# EAGLE design design1 (EAGLE 9.5.1)

## Sheet 1 of 2
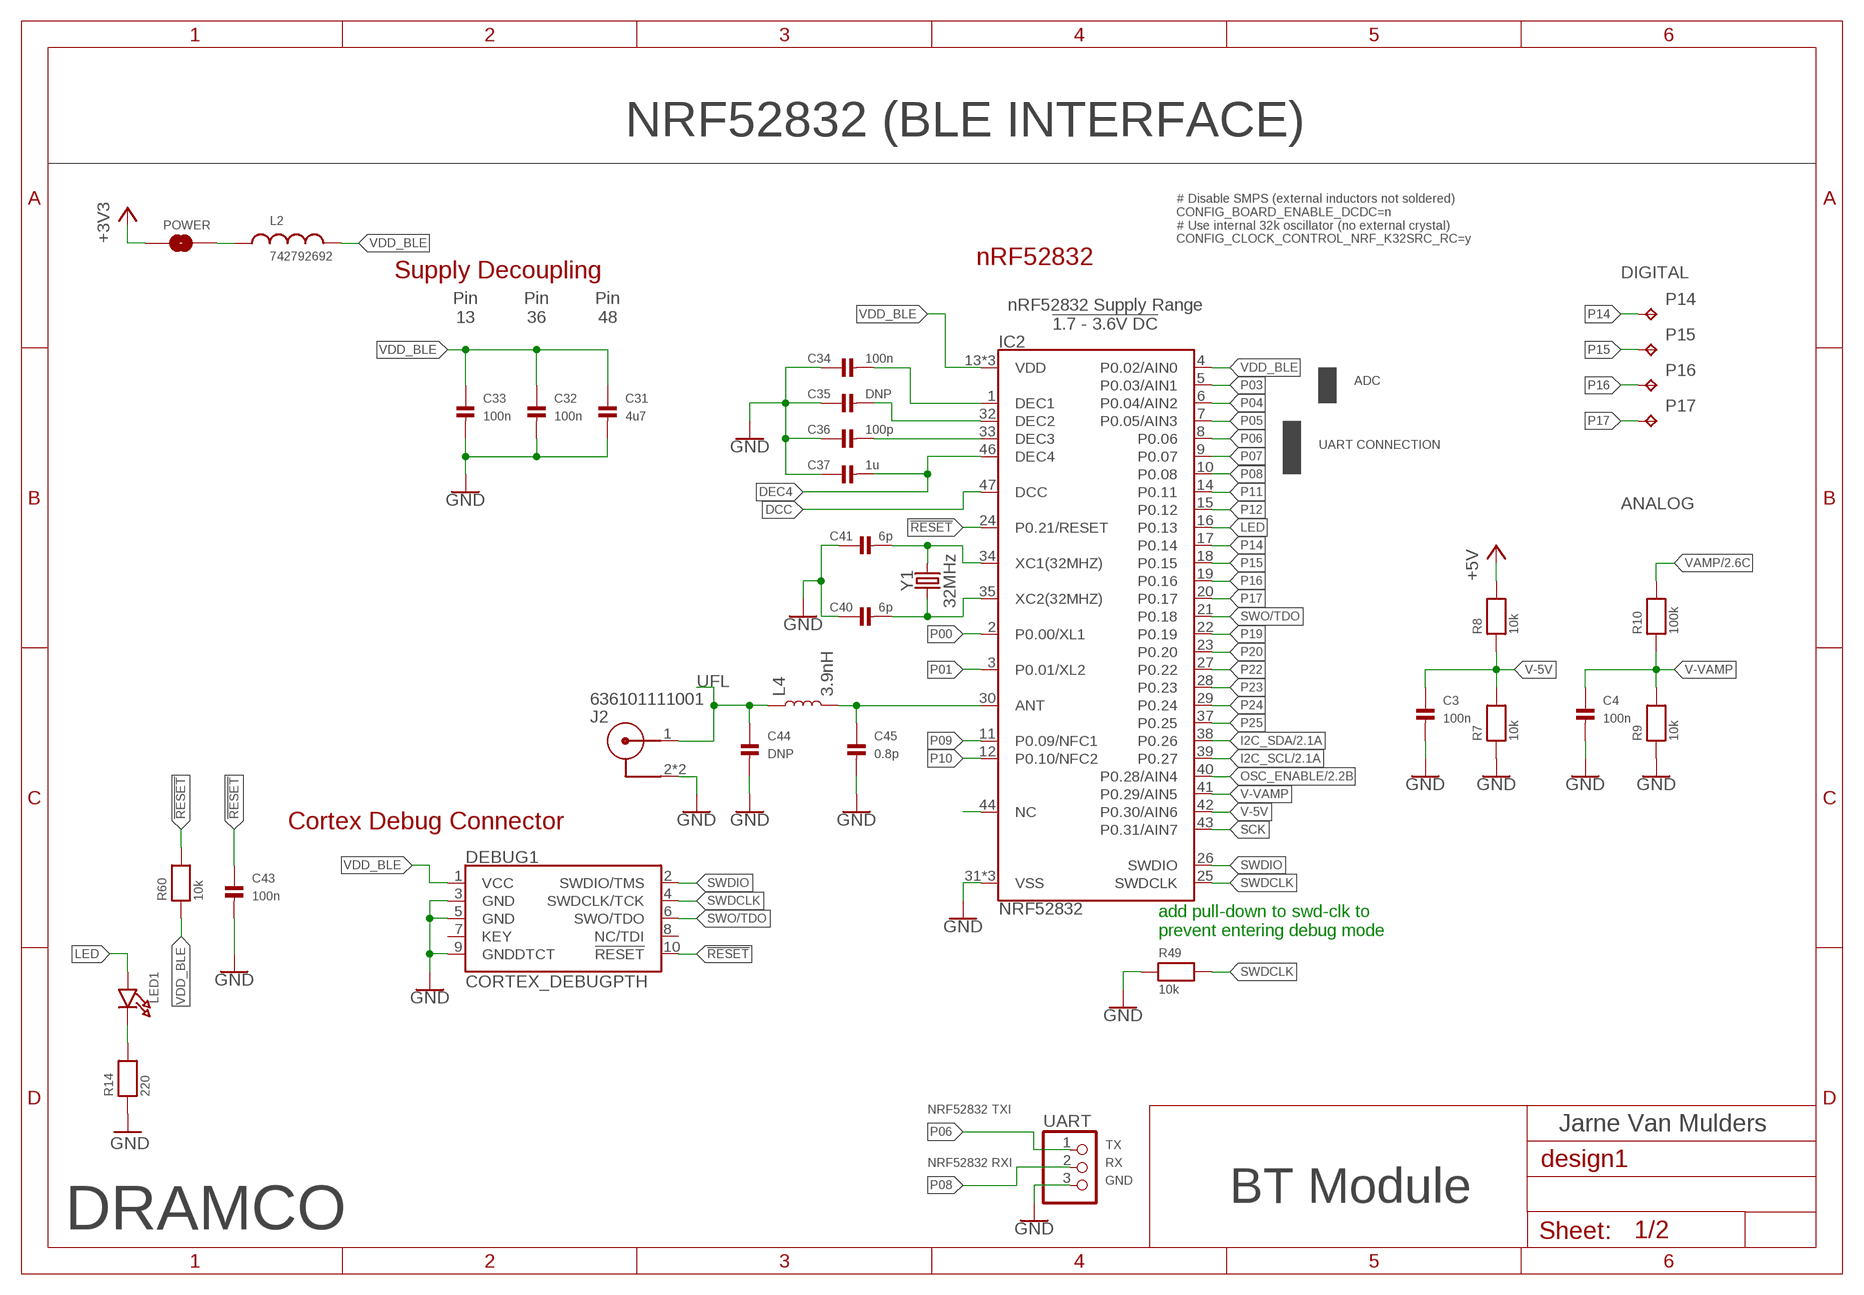
[diagram p0: schematic, sheet 1]

### Parts
C3  100n  CAP_CERAMIC0402  [0402]
C4  100n  CAP_CERAMIC0402  [0402]
C31  4u7  CAP_CERAMIC0603  [0603]
C32  100n  CAP_CERAMIC0402  [0402]
C33  100n  CAP_CERAMIC0402  [0402]
C34  100n  CAP_CERAMIC0402  [0402]
C35  DNP  CAP_CERAMIC0402  [0402]
C36  100p  CAP_CERAMIC0402  [0402]
C37  1u  CAP_CERAMIC0402  [0402]
C40  6p  CAP_CERAMIC0402  [0402]
C41  6p  CAP_CERAMIC0402  [0402]
C43  100n  CAP_CERAMIC0402  [0402]
C44  DNP  CAP_CERAMIC0402  [0402]
C45  0.8p  CAP_CERAMIC0402  [0402]
DEBUG1  CORTEX_DEBUGPTH  [2X5-PTH-1.27MM]
IC2  NRF52832  NRF52832-EXTENDED  [QFN48-6X6MM-EXTENDED]
J2  636101111001  [636101111001]
L2  742792692  WE-CBF_0603_742792692_WB_HS  [WE-CBF_0603(W=2.2)]
L4  3.9nH  INDUCTOR-0402-3.9NH  [0402]
LED1  LED0805  [CHIPLED_0805]
P14  TPTP10SQ  [TP10SQ]
P15  TPTP10SQ  [TP10SQ]
P16  TPTP10SQ  [TP10SQ]
P17  TPTP10SQ  [TP10SQ]
POWER  JUMPER-SMT_2_NO_NO-SILK  [SMT-JUMPER_2_NO_NO-SILK]
R7  10k  RESISTOR0402  [0402]
R8  10k  RESISTOR0402  [0402]
R9  10k  RESISTOR0402  [0402]
R10  100k  RESISTOR0402  [0402]
R14  220  RESISTOR0603  [0603]
R49  10k  RESISTOR0402  [0402]
R60  10k  RESISTOR0402  [0402]
UART  HEADER-1X3ROUND  [1X03_ROUND]
Y1  32MHz  CRYSTAL-32MHZ-SMD-2.0X1.6MM  [CRYSTAL-SMD-2.0X1.6MM]

### Nets
!RESET!: C43.1 DEBUG1.10(!RESET) IC2.24(P0.21/RESET) R60.2
+3V3: POWER.1 ; also sheet 2
+5V: R8.2 ; also sheet 2
ANT: C45.1 IC2.30(ANT) L4.2
DCC: IC2.47(DCC)
DEC4: C37.2 IC2.46(DEC4)
DEC5: C34.2 IC2.1(DEC1)
DEC6: C35.2 IC2.32(DEC2)
DEC8: C36.2 IC2.33(DEC3)
GND: C3.2 C4.2 C31.2 C32.2 C33.2 C34.1 C35.1 C36.1 C37.1 C40.1 C41.1 C43.2 C44.2 C45.2 DEBUG1.3(GND) DEBUG1.5(GND) DEBUG1.9(GNDDTCT) IC2.31(VSS) IC2.45(VSS) IC2.EP(VSS) J2.2 J2.3 R7.1 R9.1 R14.1 R49.1 UART.3 ; also sheet 2
I2C_SCL: IC2.39(P0.27) ; also sheet 2
I2C_SDA: IC2.38(P0.26) ; also sheet 2
LED: IC2.16(P0.13) LED1.A
N$5: LED1.C R14.2
N$14: L2.1 POWER.2
NC: IC2.44(NC)
OSC_ENABLE: IC2.40(P0.28/AIN4) ; also sheet 2
P00: IC2.2(P0.00/XL1)
P01: IC2.3(P0.01/XL2)
P03: IC2.5(P0.03/AIN1)
P04: IC2.6(P0.04/AIN2)
P05: IC2.7(P0.05/AIN3)
P06: IC2.8(P0.06) UART.1
P07: IC2.9(P0.07)
P08: IC2.10(P0.08) UART.2
P09: IC2.11(P0.09/NFC1)
P10: IC2.12(P0.10/NFC2)
P11: IC2.14(P0.11)
P12: IC2.15(P0.12)
P14: IC2.17(P0.14) P14.TP
P15: IC2.18(P0.15) P15.TP
P16: IC2.19(P0.16) P16.TP
P17: IC2.20(P0.17) P17.TP
P19: IC2.22(P0.19)
P20: IC2.23(P0.20)
P22: IC2.27(P0.22)
P23: IC2.28(P0.23)
P24: IC2.29(P0.24)
P25: IC2.37(P0.25)
SCK: IC2.43(P0.31/AIN7)
SWDCLK: DEBUG1.4(SWDCLK/TCK) IC2.25(SWDCLK) R49.2
SWDIO: DEBUG1.2(SWDIO/TMS) IC2.26(SWDIO)
SWO/TDO: DEBUG1.6(SWO/TDO) IC2.21(P0.18)
UFL: C44.1 J2.1 L4.1
V-5V: C3.1 IC2.42(P0.30/AIN6) R7.2 R8.1
V-VAMP: C4.1 IC2.41(P0.29/AIN5) R9.2 R10.1
VAMP: R10.2 ; also sheet 2
VDD_BLE: C31.1 C32.1 C33.1 DEBUG1.1(VCC) IC2.4(P0.02/AIN0) IC2.13(VDD) IC2.36(VDD) IC2.48(VDD) L2.2 R60.1
XC1: C41.2 IC2.34(XC1(32MHZ)) Y1.3
XC2: C40.2 IC2.35(XC2(32MHZ)) Y1.1
Unconnected: DEBUG1.7(KEY) DEBUG1.8(NC/TDI)

### Notes on the sheet
- NRF52832 (BLE INTERFACE)
- # Disable SMPS (external inductors not soldered)
  CONFIG_BOARD_ENABLE_DCDC=n
  # Use internal 32k oscillator (no external crystal)
  CONFIG_CLOCK_CONTROL_NRF_K32SRC_RC=y
- nRF52832
- Supply Decoupling | DIGITAL
- nRF52832 Supply Range
  !1.7 - 3.6V DC!
- Pin
  13
- Pin
  36
- Pin
  48
- ADC
- UART CONNECTION
- ANALOG
- Cortex Debug Connector
- add pull-down to swd-clk to 
  prevent entering debug mode
- NRF52832 TXI
- Jarne Van Mulders
- TX
- NRF52832 RXI | RX
- GND
- BT Module
- DRAMCO

## Sheet 2 of 2
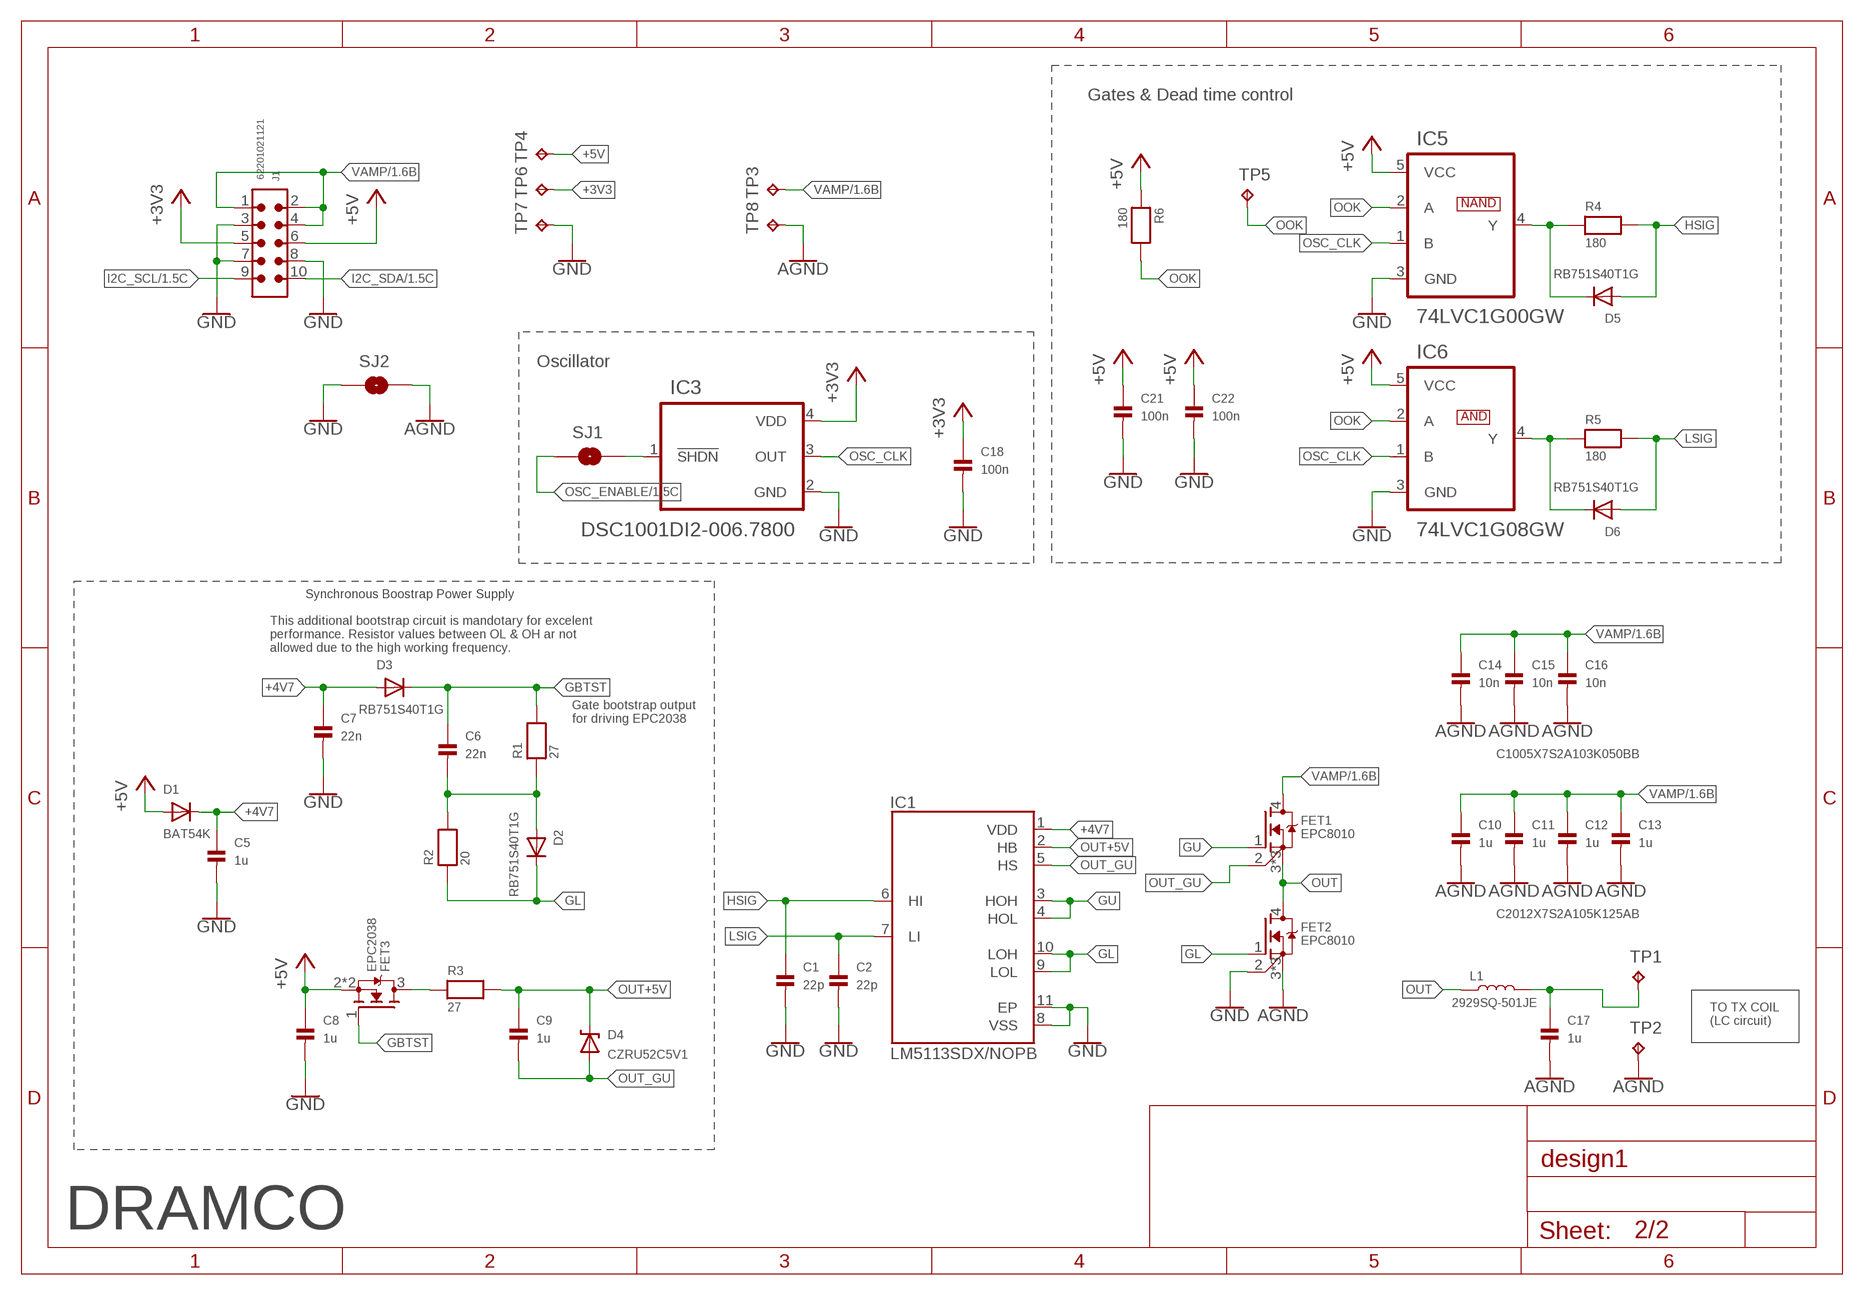
[diagram p1: schematic, sheet 2]

### Parts
C1  22p  CAP_CERAMIC0402  [0402]
C2  22p  CAP_CERAMIC0402  [0402]
C5  1u  CAP_CERAMIC0402  [0402]
C6  22n  CAP_CERAMIC0402  [0402]
C7  22n  CAP_CERAMIC0402  [0402]
C8  1u  CAP_CERAMIC0402  [0402]
C9  1u  CAP_CERAMIC0402  [0402]
C10  1u  CAP_CERAMIC0805  [0805]
C11  1u  CAP_CERAMIC0805  [0805]
C12  1u  CAP_CERAMIC0805  [0805]
C13  1u  CAP_CERAMIC0805  [0805]
C14  10n  CAP_CERAMIC0402  [0402]
C15  10n  CAP_CERAMIC0402  [0402]
C16  10n  CAP_CERAMIC0402  [0402]
C17  1u  CAP_CERAMIC0805  [0805]
C18  100n  CAP_CERAMIC0603  [0603]
C21  100n  CAP_CERAMIC0402  [0402]
C22  100n  CAP_CERAMIC0402  [0402]
D1  BAT54K  DIODESOD-523  [SOD-523]
D2  RB751S40T1G  DIODESOD-523  [SOD-523]
D3  RB751S40T1G  DIODESOD-523  [SOD-523]
D4  CZRU52C5V1  CZRU52  [SOD-523F]
D5  RB751S40T1G  DIODESOD-523  [SOD-523]
D6  RB751S40T1G  DIODESOD-523  [SOD-523]
FET1  EPC8010  [BGA-8010]
FET2  EPC8010  [BGA-8010]
FET3  EPC2038  [BGA-2038]
IC1  LM5113SDX/NOPB  [SON80P400X400X80-11N]
IC3  DSC1001DI2-006.7800  [2.5X2.0MMPLASTICPACKAGE]
IC5  74LVC1G00GW  [SOT65P210X110-5N]
IC6  74LVC1G08GW  74LVC1G00GW  [SOT65P210X110-5N]
J1  62201021121  6220XX21121_62201021121  [62201021121]
L1  2929SQ-501JE  2929SQ-501  [2929SQ-501]
R1  27  RESISTOR0402  [0402]
R2  20  RESISTOR0402  [0402]
R3  27  RESISTOR0402  [0402]
R4  180  RESISTOR0402  [0402]
R5  180  RESISTOR0402  [0402]
R6  180  RESISTOR0402  [0402]
SJ1  SOLDERJUMPERNO  [SJ_2S-NO]
SJ2  SOLDERJUMPERNO  [SJ_2S-NO]
TP1  TPTP20SQ  [TP20SQ]
TP2  TPTP20SQ  [TP20SQ]
TP3  TPTP20SQ  [TP20SQ]
TP4  TPTP10SQ  [TP10SQ]
TP5  TPTP10SQ  [TP10SQ]
TP6  TPTP10SQ  [TP10SQ]
TP7  TPTP10SQ  [TP10SQ]
TP8  TPTP20SQ  [TP20SQ]

### Nets
+3V3: C18.1 IC3.4(VDD) J1.5 TP6.TP ; also sheet 1
+4V7: C5.1 C7.1 D1.K(C) D3.A IC1.1(VDD)
+5V: C8.1 C21.1 C22.1 D1.A FET3.2(S) FET3.4(S) IC5.5(VCC) IC6.5(VCC) J1.6 R6.1 TP4.TP ; also sheet 1
AGND: C10.2 C11.2 C12.2 C13.2 C14.2 C15.2 C16.2 C17.2 FET2.3(S) FET2.5(S) FET2.6(S) SJ2.2 TP2.TP TP8.TP
GBTST: C6.1 D3.K(C) FET3.1(G) R1.2
GL: D2.K(C) FET2.1(G) IC1.9(LOL) IC1.10(LOH) R2.1
GND: C1.2 C2.2 C5.2 C7.2 C8.2 C18.2 C21.2 C22.2 FET2.2(SR) IC1.8(VSS) IC1.11(EP) IC3.2(GND) IC5.3(GND) IC6.3(GND) J1.3 J1.7 J1.8 SJ2.1 TP7.TP ; also sheet 1
GU: FET1.1(G) IC1.3(HOH) IC1.4(HOL)
HSIG: C1.1 D5.A IC1.6(HI) R4.2
I2C_SCL: J1.9 ; also sheet 1
I2C_SDA: J1.10 ; also sheet 1
LSIG: C2.1 D6.A IC1.7(LI) R5.2
N$1: FET3.3(D) R3.1
N$2: D5.K(C) IC5.4(Y) R4.1
N$3: IC3.1(!SHDN!) SJ1.2
N$4: D6.K(C) IC6.4(Y) R5.1
N$7: C6.2 D2.A R1.1 R2.2
N$8: C17.1 L1.2 TP1.TP
OOK: IC5.2(A) IC6.2(A) R6.2 TP5.TP
OSC_CLK: IC3.3(OUT) IC5.1(B) IC6.1(B)
OSC_ENABLE: SJ1.1 ; also sheet 1
OUT: FET1.3(S) FET1.5(S) FET1.6(S) FET2.4(D) L1.1
OUT+5V: C9.1 D4.1(C) IC1.2(HB) R3.2
OUT_GU: C9.2 D4.2(A) FET1.2(SR) IC1.5(HS)
VAMP: C10.1 C11.1 C12.1 C13.1 C14.1 C15.1 C16.1 FET1.4(D) J1.1 J1.2 J1.4 TP3.TP ; also sheet 1

### Notes on the sheet
- Gates & Dead time control
- NAND
- Oscillator
- AND
- Synchronous Boostrap Power Supply
- This additional bootstrap circuit is mandotary for excelent
  performance. Resistor values between OL & OH ar not 
  allowed due to the high working frequency.
- Gate bootstrap output 
  for driving EPC2038
- C1005X7S2A103K050BB
- C2012X7S2A105K125AB
- TO TX COIL
  (LC circuit)
- DRAMCO

## Library data of the parts
C1-C18 C21 C22 C31-C37 C40 C41 C43-C45 = microbuilder:CAP_CERAMIC: Ceramic Capacitors 0402 - 0402 Surface Mount Capacitors 16pF 50V 5% [Digikey: 445-4899-2-ND] 18pF 50V 5% [Digikey: 490-1281-2-ND] 22pF 50V 5% [Digikey: 490-1283-2-ND] 68pF 50V 5% [Digikey: 490-1289-2-ND] 0.1uF 10V 10% [Digikey: 490-1318-2-ND] 1.0uF 6.3V 10% [Digikey: 490-1320-2-ND] 0603 - 0603 Surface Mount Capacitors 16 pF 50V 5% [Digikey: 445-5051-2-ND] 22 pF 50V [Digikey: PCC220ACVTR-ND] 33 pF 50V 5% [Digikey: 490-1415-1-ND] 56pF 50V 5% [Digikey: 490-1421-1-ND] 220pF 50V 5% [Digikey: 445-1285-1-ND] 680 pF 50V 2200 pF 50V 5% C0G [Digikey: 445-1297-1-ND] 5600 pF 100V 5% X7R [Digikey: 478-3711-1-ND] 0.1 µF 25V 10% [Digikey: PCC2277TR-ND] 0.22 µF 16V 10% X7R [Digikey: 445-1318-1-ND] 1.0 µF 25V 10% [Digikey: 445-5146-2-ND] 0603 - RF Specific 3pF 250V +/-0.1pF RF [Digikey: 712-1347-1-ND] 18 pF 250V 5% [Digikey: 478-3505-1-ND or 712-1322-1-ND] 56 pF 250V 5% C0G RF [Digikey: 490-4867-1-ND] 68 pF 250V RF [Digikey: 490-4868-1-ND] 0805 - 0805 Surface Mount Capacitors 220 pF 250V 2% RF Ceramic Capacitor [Digikey: 712-1398-1-ND] 1000 pF 50V 2% NP0 Ceramic Capacitor [Digikey: 478-3760-1-ND] 0.1 µF 25V 10% Ceramic Capacitor [Digikey: PCC1828TR-ND] 1.0 µF 16V 10% Ceramic Capacitor[Digikey: 490-1691-2-ND] 10.0 µF 10V 10% Ceramic Capacitor[Digikey: 709-1228-1-ND] 10.0 uF 16V 10% Ceramic Capacitor [Digikey: 478-5165-2-ND] 47 uF 6.3V 20% Ceramic Capacitor [Digikey: 587-1779-1-ND or 399-5506-1-ND] 1206 - 1206 Surface Mount Capacitors 47uF 10V 20% Ceramic Capacitor [Digikey: 490-5528-1-ND or 399-5508-1-ND or 445-6010-1-ND] 100uF 6.3V -20%, +80% Y5V Ceramic Capacitor (Digikey: 490-4512-1-ND, Mouser: 81-GRM31CF50J107ZE1L)
D1-D3 D5 D6 = microbuilder:DIODE: Diode SMA Model Volts Amps Type Vf Vr Digikey # Notes SSA34-E3 40V 3A Schottky 480mV @ 3A 200uA @ 40V SSA34-E3/61TGITR-ND CDBA120-G 20V 1A Schottky 500mV @ 1A 500uA @ 20V 641-1014-6-ND REEL MBRA210 10V 2A Schottky 350mV @ 2A 700uA @ 10V MBRA210LT3 SOD-123 Model Volts Amps Type Vf Vr Order # Notes BAT54T1G 30V 200mA Schottky 800mV @ 200mA 2uA @ 25V BAT54T1GOSTR-ND B0530W 30V 500mA Schottky 430mV @ 500mA 130uA @ 30V B0530W-FDICT-ND REEL MBR120 1A 20V Schottky 340mV @ 1A MBR120VLSFT1GOSCT-ND SOD-323 Model Volts Amps Type Vf Vr Order # Notes PMEG2005EJ 20V 500mA Schottky 355mV @ 500mA 568-4110-1-ND ZLLS410 10V 570mA Schottky 380mV @ 570mA ZLLS410CT-ND 1N4148WS 75V 150mA Silicon/Simple 1V 1N4148WSFSCT-ND REEL SOD-523 Model Volts Amps Type Vf Vr Order # Notes BAT54XV2 30V 200mA Schottky 0.8V @ 100mA BAT54XV2CT-ND TB751S 30V 30mA Schottky RB751S-40TE61CT-ND SOT23-R/W (R = Solder Paste/Reflow Ovens, W = Hand-Soldering) Model Volts Amps Type Vf Vr Order # Notes BAT54FILM 40V 300mA Schottky 497-7162-1-ND
D4 = microbuilder:CZRU52
DEBUG1 = SparkFun-Connectors:CORTEX_DEBUG: Cortex Debug Connector Datasheet <http://infocenter.arm.com/help/topic/com.arm.doc.faqs/attached/13634/cortex_debug_connectors.pdf>
FET1 FET2 = EPC-MOS:EPC8010
FET3 = EPC-MOS:EPC2038
IC1 = LM5113SDX_NOPB:LM5113SDX/NOPB: 5A, 100V Half-Bridge Gate Driver for Enhancement Mode GaN FETs 10-WSON -40 to 125 Check availability <https://pricing.snapeda.com/parts/LM5113SDX/NOPB/Texas%20Instruments/view-part?ref=eda>; AVAILABILITY: In Stock; DESCRIPTION: 1.2-A/5-A, 100-V half bridge gate driver for GaNFET 10-WSON -40 to 125; MF: Texas Instruments; MP: LM5113SDX/NOPB; PACKAGE: WSON-10 Texas Instruments; PRICE: None; PURCHASE-URL: https://pricing.snapeda.com/search?q=LM5113SDX/NOPB&ref=eda
IC2 = SparkFun-RF:NRF52832-EXTENDED
IC3 = DSC1001:DSC1001DI2-006.7800: None Check availability <https://pricing.snapeda.com/parts/DSC1001DI1-025.0000/Microchip/view-part?ref=eda>; AVAILABILITY: In Stock; DESCRIPTION: 25 MHz XO (Standard) CMOS Oscillator 1.8V ~ 3.3V Standby (Power Down) 4-SMD, No Lead; MF: Microchip; MP: DSC1001DI1-025.0000; PACKAGE: SMD-4 Microchip; PRICE: None; PURCHASE-URL: https://pricing.snapeda.com/search?q=DSC1001DI1-025.0000&ref=eda
IC5 IC6 = 74LVC1G00GW:74LVC1G00GW: Single 2-input NAND gate Check availability <https://pricing.snapeda.com/parts/74LVC1G00GW/Nexperia%20USA/view-part?ref=eda>; AVAILABILITY: In Stock; DESCRIPTION: NAND Gate IC 1 Channel - 5-TSSOP; MF: Nexperia USA; MP: 74LVC1G00GW; PACKAGE: TSSOP-5 Nexperia USA; PRICE: None; PURCHASE-URL: https://pricing.snapeda.com/search?q=74LVC1G00GW&ref=eda
J1 = Eagle_WR-PHD (rev22a):6220XX21121_62201021121: WR-PHD 1.27 mm THT Dual Pin Header ARTICLE PROPERTIES: Pins:4;​ 8;​ 10;​ 14;​ 16;​ 20;​ 28 KIND PROPERTIES: Pitch：1.27 mm Quality Class:3 as per CECC 75 301-802 Rows：Dual Gender：Pin Header Type：Straight MATERIAL PROPERTIES: Insulator Material :PA9T Insulator Flammability Rating:UL94 V-0 Contact Material:Copper Alloy Contact Plating:Gold Contact Type:Stamped GENERAL INFORMATION Operating Temperature:-40 up to +105 °C Compliance:Lead free / RoHS ELECTRICAL PROPERTIES: Rated Current:1 A;​ max. IR1:1 A Withstanding Voltage:500 V (AC) Contact Resistance:20 mΩ RISO:1000 MΩ CERTIFICATION UL Approval:E323964 PACKAGING PROPERTIES Packaging:Box Packaging Unit:1000;​ 800;​ 500;​ 200 <https://katalog.we-online.com/media/images/v2/o33223v209%20Family_WR-PHD_6220xx21121.jpg> Details see: https://katalog.we-online.com/en/em/PHD_1_27_THT_DUAL_PIN_HEADER_6220XX21121 Updated by Yingchun,Shan 2019-10-25 2019 (C) Würth Elektronik; DATASHEET-URL: https://www.we-online.com/redexpert/spec/62201021121?ae; GENDER: Pin Header; IR: 1A; MOUNT: THT; PACKAGING: Box; PART-NUMBER: 62201021121; PINS: 10; PITCH: 1.27mm; ROWS: Dual; TYPE: Straight
J2 = Eagle_WR-UMRF (rev21b):636101111001: WR-UMRF PCB Receptacle SMT with 3 Pads MATERIAL PROPERTIES Insulator Material LCP Insulator Color Natural Insulator Flammability Rating UL94 V-0 Center Contact Material Brass Center Contact Plating Gold over Nickel GENERAL INFORMATION Operating Temperature -40 up to +90 °C <https://www.we-online.com/katalog/media/o325314v209%20Single_WR-UMRF_63610111x001.jpg> Details see: https://www.we-online.com/katalog/en/PCB_RECECTACLE_SMT_WITH_3_PADS Updated by Ella Wu 2021-07-20 2021(C) Würth Elektronik; DATASHEET-URL: https://www.we-online.com/catalog/datasheet/636101111001.pdf; GENDER: PCB Receptacle; MOUNT: SMT; PART-NUMBER: 636101111001; Z: 50Ohm
L1 = 2929SQ:2929SQ-501
L2 = PowerMagnetics (rev18e):WE-CBF_0603: WE-CBF SMD EMI Suppression Ferrite Bead Characteristics Reliable Ni-Sn electrodes High rated current up to 6 A Operating temperature: –55 ºC to +125 ºC Applications Perfect as data lined filter and for uncoupling of distribution voltage Variant abbreviation WB means WIDE BAND HS means HIGH SPEED HC means HIGH CURRENT <http://katalog.we-online.de/media/images/v2/Family_WE-CBF.jpg> Details see: http://katalog.we-online.de/en/pbs/WE-CBF Updated on 2014-06-19 2014 (C) Wurth Elektronik; WE-NUMBER: 742792692/1800Ω(Z@100MHz)
L4 = nrf52832-breakout-temp:INDUCTOR: Inductors Resist changes in electrical current. Basically a coil of wire. SparkFun Products: SparkFun Load Cell Amplifier - HX711 <https://www.sparkfun.com/products/13879> IOIO-OTG - V2.2 <https://www.sparkfun.com/products/13613>; PROD_ID: NDUC-13457
LED1 = microbuilder:LED: LED 0603 - 0603 Surface Mount Package 2mA: Green LED - Low Power (3.9mcd, 2ma, 1.7Vf) - Digikey: 475-2709-2-ND Orange LED - Low Power (9.8mcd, 2ma, 1.8Vf) - Digikey: 475-1194-2-ND Red LED - Low Power (5mcd, 2ma, 1.8Vf) - Digikey: 475-1195-2-ND Yellow LED - Low Power (7mcd, 2ma, 1.8Vf) - Digikey: 475-1196-2-ND 5mA: Blue LED - Low Power (17mcd, 5ma, 2.9Vf) - Digikey: LNJ937W8CRACT-ND 0805 - 0805 Surface Mount Package 2mA: Red LED (8.8mcd, 2mA, 1.8Vf, Clear) - Low Power [Digikey: 475-2510-1-ND] Green LED (5mcd, 2mA, 1.8Vf, Clear) - Low Power [Digikey: 475-2730-1-ND] Yellow LED (11.3mcd, 2mA, 1.8Vf, Clear) - Low Power [Digikey: 475-2555-1-ND] 20mA: Red LED (104mcd, 20mA, Diffused) - LS R976 [Digikey: 475-1278-6-ND] Red LED (12mcd, 20mA, 2.0Vf, Clear) - APT2012EC [Digikey: 754-1128-1-ND] Green LED (15mcd, 20mA, 2.2Vf, Clear) - APT2012GC [Digikey: 754-1131-1-ND] Orange LED (160mcd, 20mA, 2.1Vf, Clear) - APT2012SECK [Digikey: 754-1130-1-ND] 1206 - 1206 Surface Mount Package Green LED (26mcd, 20mA, Diffused) - LG N971 [Digikey: 475-1407-6-ND] Red LED (15mcd, 20mA, Diffused) - LH N974 [Digikey: 475-1416-6-ND]
P14-P17 TP1-TP8 = testpad:TP: Test pad
POWER = SparkFun-Jumpers:JUMPER-SMT_2_NO: Normally open jumper This jumper has two pads in close proximity to each other. Apply solder to close the connection. Round pads are easier to solder for beginners, but are a lot larger. SparkFun Product that uses the round pads: SparkFun EL Sequencer <https://www.sparkfun.com/products/12781>
R1-R10 R14 R49 R60 = microbuilder:RESISTOR: Resistors 0402 - 0402 Surface Mount Package 22 Ohm 1% 1/16W [Digikey: 311-22.0LRTR-ND] 33 Ohm 5% 1/16W 1.0K 5% 1/16W 1.5K 5% 1/16W 2.0K 1% 1/16W 10.0K 1% 1/16W [Digikey: 311-10.0KLRTR-ND] 10.0K 5% 1/16W [Digikey: RMCF0402JT10K0TR-ND] 12.1K 1% 1/16W [Digikey: 311-22.0LRTR-ND] 100.0K 5% 1/16W 0603 - 0603 Surface Mount Package 0 Ohm 1/10 Watt 1% Resistor 15 Ohm 1/10 Watt 1% Resistor 33 Ohm 1/10 Watt 1% Resistor 49.9 Ohm 1/10 Watt 1% Resistor 100 Ohm 1/10 Watt 1% Resistor 150 Ohm 1/10 Watt 1% Resistor 240 Ohm 1/10 Watt 1% Resistor 390 Ohm 1/10 Watt 1% Resistor 560 Ohm 1/10 Watt 1% Resistor 680 Ohm 1/10 Watt 1% Resistor 750 Ohm 1/10 Watt 1% Resistor 1.0K Ohm 1/10 Watt 1% Resistor 1.5K Ohm 1/10 Watt 1% Resistor 2.0K Ohm 1/10 Watt 1% Resistor 2.2K Ohm 1/10 Watt 1% Resistor 3.3K Ohm 1/10 Watt 1% Resistor 4.7K Ohm 1/10 Watt 1% Resistor 10.0K Ohm 1/10 Watt 1% Resistor 12.0K Ohm 1/10 Watt 1% Resistor 12.1K Ohm 1/10 Watt 1% Resistor 20.0K Ohm 1/10 Watt 1% Resistor 33.0K Ohm 1/10 Watt 1% Resistor 100.0K Ohm 1/10 Watt 1% Resistor 0805 - 0805 Surface Mount Package 0 Ohm 1/8 Watt 1% Resistor 33 Ohm 1/8 Watt 1% Resistor 100 Ohm 1/8 Watt 1% Resistor 150 Ohm 1/8 Watt 1% Resistor 200 Ohm 1/8 Watt 1% Resistor 240 Ohm 1/8 Watt 1% Resistor 330 Ohm 1/8 Watt 1% Resistor 390 Ohm 1/8 Watt 1% Resistor 470 Ohm 1/8 Watt 1% Resistor 1.0K Ohm 1/8 Watt 1% Resistor 1.5K Ohm 1/8 Watt 1% Resistor 2.0K Ohm 1/8 Watt 1% Resistor 4.7K Ohm 1/8 Watt 1% Resistor 5.1K Ohm 1/8 Watt 1% Resistor 5.6K Ohm 1/8 Watt 1% Resistor 10.0K Ohm 1/8 Watt 1% Resistor 22.0K Ohm 1/8 Watt 1% Resistor 33.0K Ohm 1/8 Watt 1% Resistor 100K Ohm 1/8 Watt 1% Resistor 1206 - 1206 Surface Mount Package 2012 - 2010 Surface Mount Package 0.11 Ohm 1/2 Watt 1% Resistor - Digikey: RHM.11UCT-ND
SJ1 SJ2 = SparkFun-Retired:SOLDERJUMPER: Solder Jumper Standard SMD solder jumper. Used to automate production. Two varients : Normally Open and Normally Closed are the same, but have different paste layers. NC will have a large amount of paste and should jumper during reflow.
UART = microbuilder:HEADER-1X3: PIN HEADER
Y1 = nrf52832-breakout-temp:CRYSTAL-32MHZ: 32MHz Crystal Digikey Example <http://www.digikey.com/product-detail/en/murata-electronics-north-america/XRCGB32M000F2P00R0/490-9769-1-ND/4952013> Frequency: 32MHz Frequency Stability: ±20ppm Frequency Tolerance: ±20ppm Load Capacitance: 6pF; PROD_ID: XTAL-13459

## Board
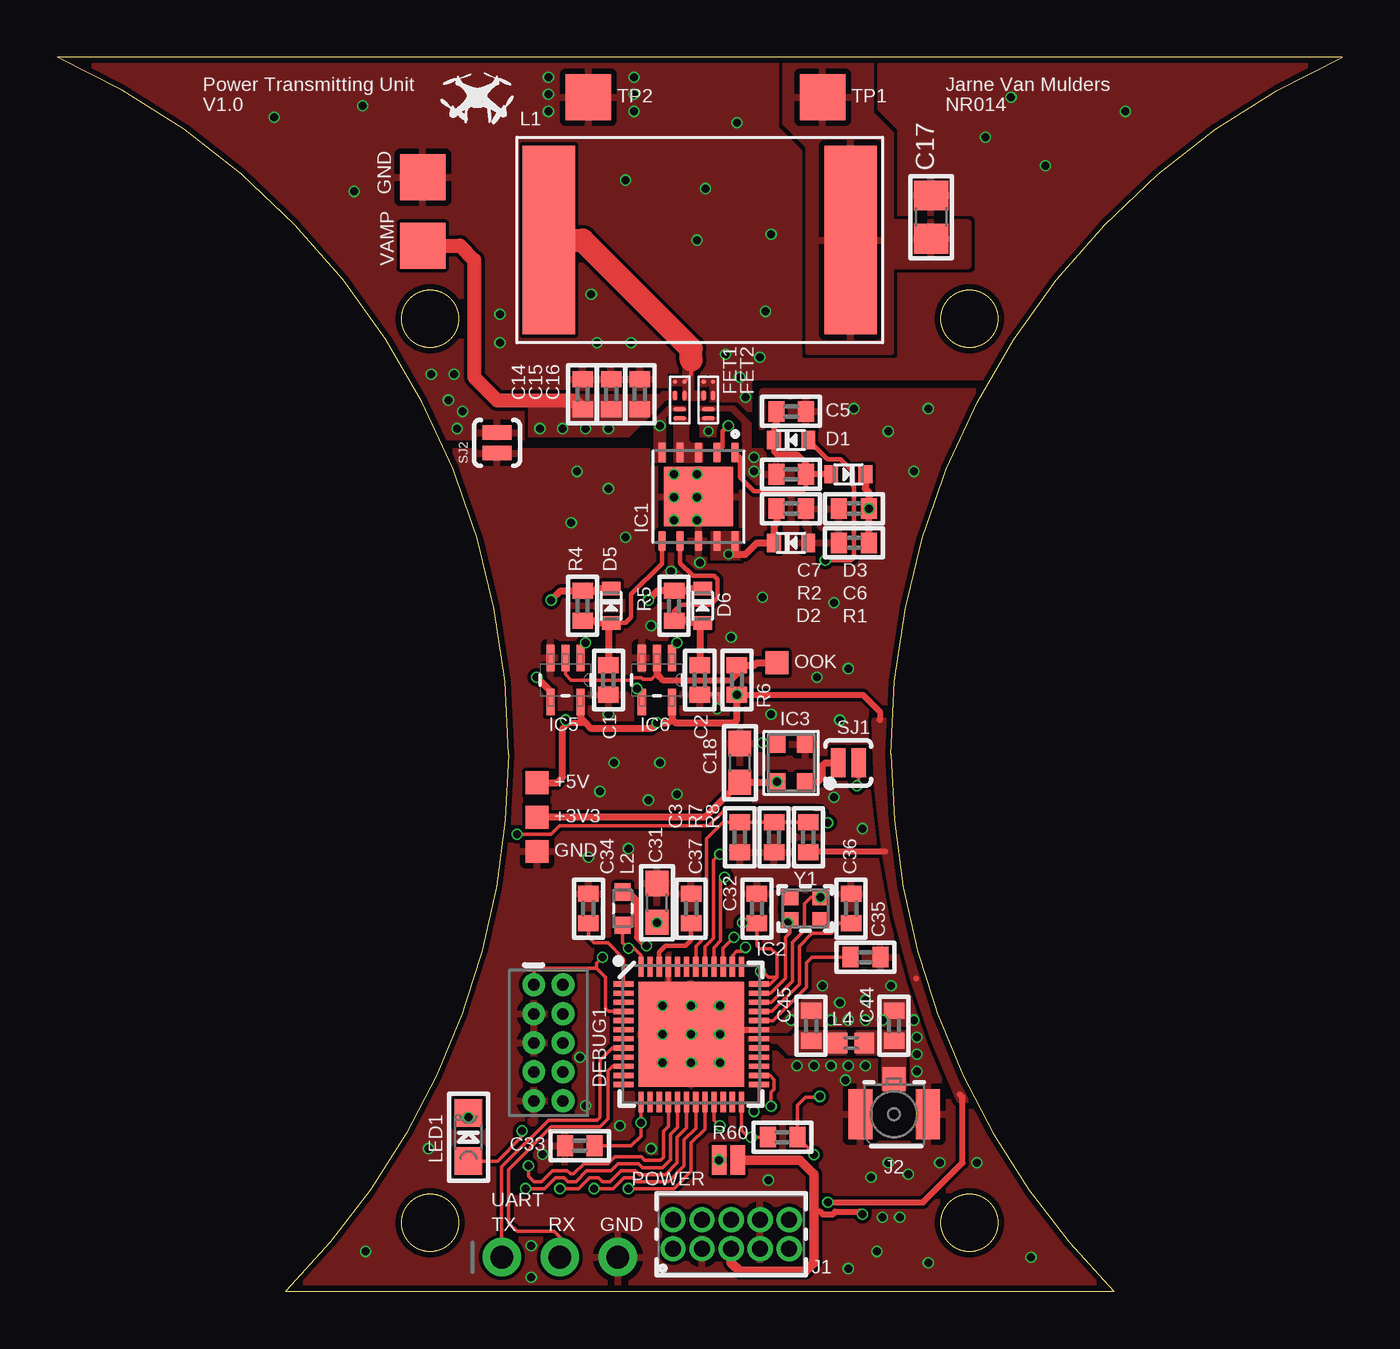
[diagram p2: board, top side]
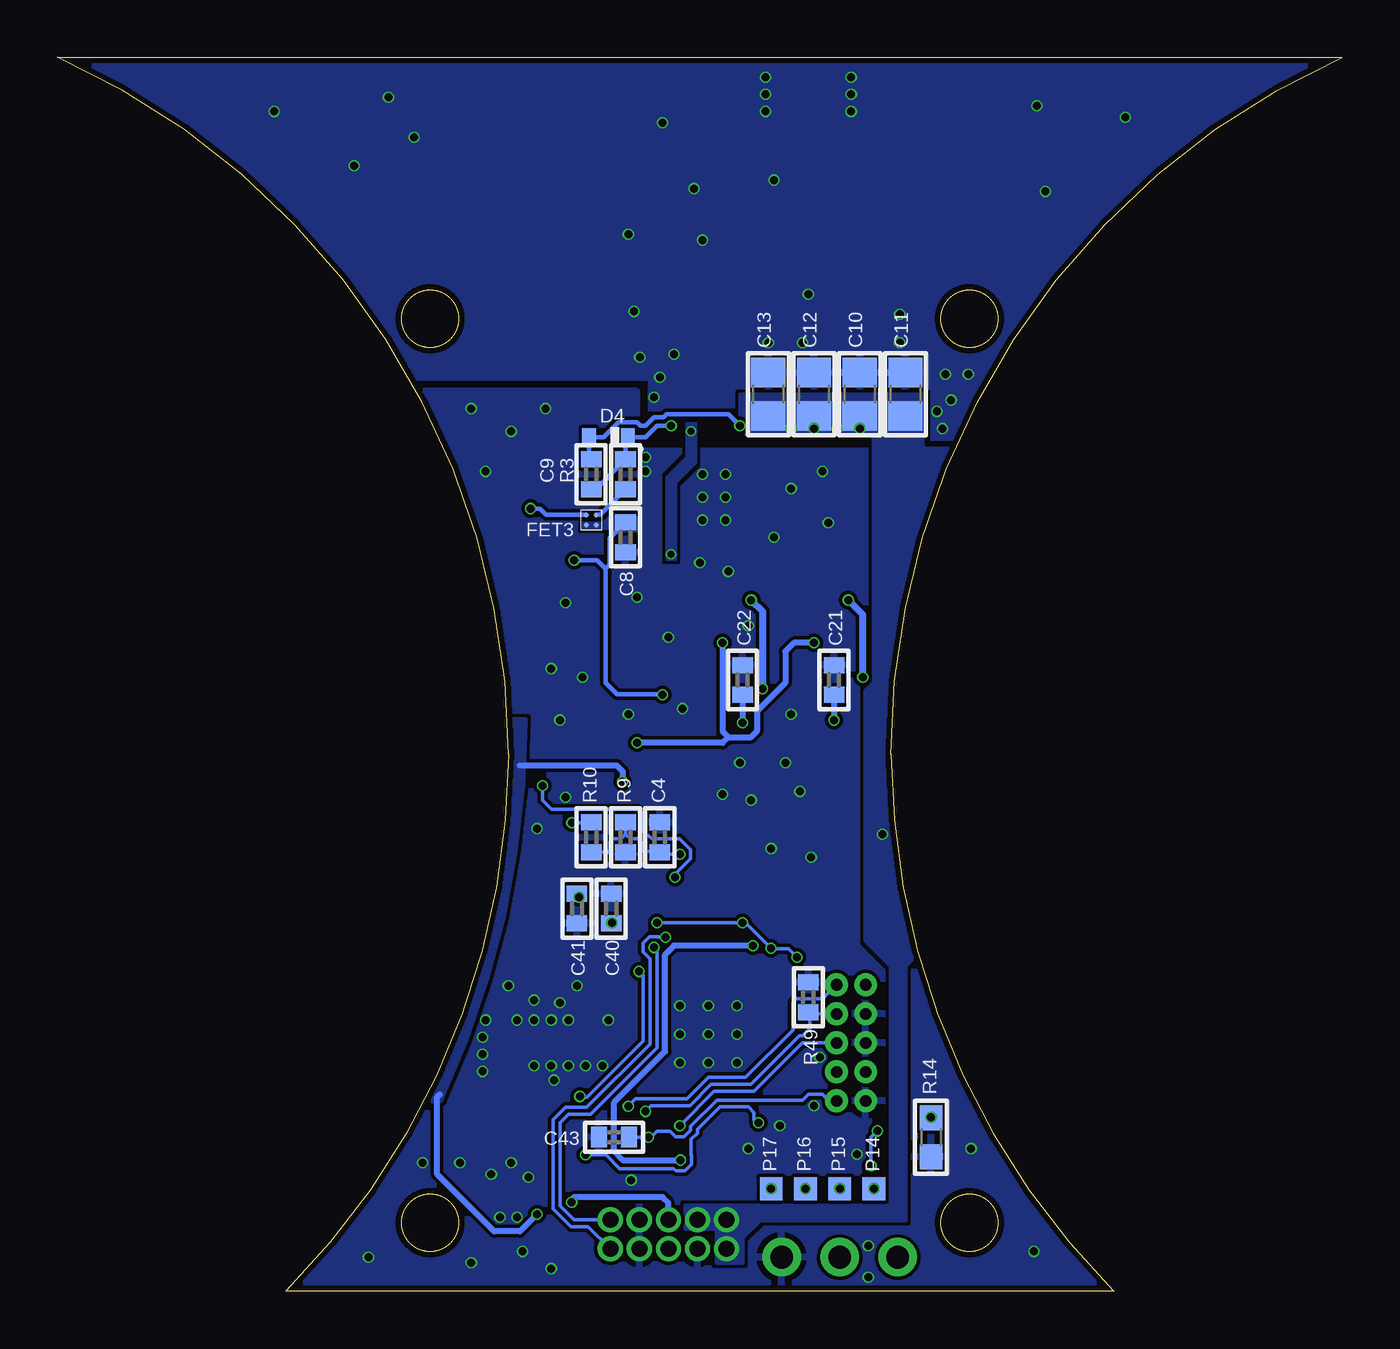
[diagram p3: board, bottom side, seen from below]

Size 56.25 x 54 mm. Coordinates in mm from the lower left corner, seen from the top.
Outline: 10,0 46.25,0 arc-45 36.5,23.5 arc-66 56.25,54 0,54 arc-66 19.75,23.5 arc-45 10,0
Outline: circle at 16.32,3 radius 1.25
Outline: circle at 39.92,3 radius 1.25
Outline: circle at 16.32,42.56 radius 1.25
Outline: circle at 39.92,42.56 radius 1.25
Copper layers (1*16): Top 0.035mm / dielectric 1.5mm / Bottom 0.035mm
Design rules "SeeedStudio_2layer_DRU_no_angle_20140221-2 *": minimum track width 6mil, minimum drill 12mil, track to track 6mil, track to pad 6mil, pad to pad 6mil, via to via 6mil, smd to smd 0mil, copper to edge 10mil, drill to drill 10mil, minimum pad ring 4mil, minimum via ring 2mil, stop-mask expansion 2mil, vias tented up to drill 100mil, thermal gap 10mil

### Footprints (pad centres in the part's own frame; a part is rotated, then mirrored left to right if it is on the bottom)
0402 = smd 0.7 x 0.9: 1 -0.65,0; 2 0.65,0
0805 = smd 1.3 x 1.5: 1 -0.95,0; 2 0.95,0
0603 = smd 1.1 x 1: 1 -0.85,0; 2 0.85,0
SOD-523 = smd 0.8 x 0.6: A 0,-0.75; K 0,0.75
SOD-523F = smd 0.6 x 0.8: 1 -0.85,0; 2 0.85,0
2X5-PTH-1.27MM = drill 0.508 pad 1: 1 -2.54,-0.635; 2 -2.54,0.635; 3 -1.27,-0.635; 4 -1.27,0.635; 5 0,-0.635; 6 0,0.635; 7 1.27,-0.635; 8 1.27,0.635; 9 2.54,-0.635; 10 2.54,0.635
BGA-8010 = smd 0.19 x 0.57: 1 -0.8,0; 2 -0.4,0 | smd 0.44 x 0.19: 3 0.2,-0.2; 4 0.2,0.2 | smd 0.19 x 0.19: 5 0.8,-0.2; 6 0.8,0.2
BGA-2038 = smd 0.21 x 0.21: 1 -0.225,0.225; 2 -0.225,-0.225; 3 0.225,0.225; 4 0.225,-0.225
SON80P400X400X80-11N = smd 0.86 x 0.32: 1 -1.935,1.6; 2 -1.935,0.8; 3 -1.935,0; 4 -1.935,-0.8; 5 -1.935,-1.6; 6 1.935,-1.6; 7 1.935,-0.8; 8 1.935,0; 9 1.935,0.8; 10 1.935,1.6 | smd 2.6 x 3: 11 0,0
QFN48-6X6MM-EXTENDED = smd 0.88 x 0.23: 1 -2.96,2.2; 2 -2.96,1.8; 3 -2.96,1.4; 4 -2.96,1; 5 -2.96,0.6; 6 -2.96,0.2; 7 -2.96,-0.2; 8 -2.96,-0.6; 9 -2.96,-1; 10 -2.96,-1.4; 11 -2.96,-1.8; 12 -2.96,-2.2; 25 2.96,-2.2; 26 2.96,-1.8; 27 2.96,-1.4; 28 2.96,-1; 29 2.96,-0.6; 30 2.96,-0.2; 31 2.96,0.2; 32 2.96,0.6; 33 2.96,1; 34 2.96,1.4; 35 2.96,1.8; 36 2.96,2.2 | smd 0.23 x 0.88: 13 -2.2,-2.96; 14 -1.8,-2.96; 15 -1.4,-2.96; 16 -1,-2.96; 17 -0.6,-2.96; 18 -0.2,-2.96; 19 0.2,-2.96; 20 0.6,-2.96; 21 1,-2.96; 22 1.4,-2.96; 23 1.8,-2.96; 24 2.2,-2.96; 37 2.2,2.96; 38 1.8,2.96; 39 1.4,2.96; 40 1,2.96; 41 0.6,2.96; 42 0.2,2.96; 43 -0.2,2.96; 44 -0.6,2.96; 45 -1,2.96; 46 -1.4,2.96; 47 -1.8,2.96; 48 -2.2,2.96 | smd 4.6 x 4.6: EP 0,0
2.5X2.0MMPLASTICPACKAGE = smd 0.75 x 0.76: 1 -0.625,0.825; 2 -0.625,-0.825; 3 0.625,-0.825; 4 0.625,0.825
SOT65P210X110-5N = smd 1.168 x 0.356: 1 -0.965,0.66; 2 -0.965,0; 3 -0.965,-0.66; 4 0.965,-0.66; 5 0.965,0.66
62201021121 = drill 0.7 pad 1.1: 1 -2.54,-0.635; 2 -2.54,0.635; 3 -1.27,-0.635; 4 -1.27,0.635; 5 0,-0.635; 6 0,0.635; 7 1.27,-0.635; 8 1.27,0.635; 9 2.54,-0.635; 10 2.54,0.635
636101111001 = smd 1 x 1.05: 1 0,-1.525 | smd 1.05 x 2.2: 2 1.475,0; 3 -1.475,0
2929SQ-501 = smd 2.29 x 8.26: 1 -6.605,0; 2 6.605,0
WE-CBF_0603(W=2.2) = smd 0.75 x 0.7: 1 -0.725,0; 2 0.725,0
0402' = smd 0.85 x 0.9: 1 -0.58,0; 2 0.58,0
CHIPLED_0805 = smd 1.2 x 1.2: A 0,-1.05; C 0,1.05
TP10SQ = smd 1 x 1: TP 0,0
SMT-JUMPER_2_NO_NO-SILK = smd 0.635 x 1.27: 1 -0.406,0; 2 0.406,0
SJ_2S-NO = smd 0.635 x 1.27: 1 -0.45,0; 2 0.45,0
TP20SQ = smd 2 x 2: TP 0,0
1X03_ROUND = drill 1 pad 1.676: 1 -2.54,0; 2 0,0; 3 2.54,0
CRYSTAL-SMD-2.0X1.6MM = smd 0.75 x 0.7: 1 -0.675,-0.5; 2 0.675,-0.5; 3 0.675,0.5; 4 -0.675,0.5

### Placement (x,y rotation side)
C1  24.12,26.75 270 top
C2  28.12,26.75 270 top
C3  29.88,19.88 270 top
C4  29.88,19.88 90 bottom
C5  32.12,38.5 0 top
C6  34.88,34.25 180 top
C7  32.12,35.75 180 top
C8  31.38,33 270 bottom
C9  32.88,35.75 90 bottom
C10  21.12,39.25 90 bottom
C11  19.12,39.25 90 bottom
C12  23.12,39.25 90 bottom
C13  25.12,39.25 90 bottom
C14  23,39.25 90 top
C15  24.25,39.25 90 top
C16  25.5,39.25 90 top
C17  38.25,47 90 top
C18  29.88,23.12 90 top
C21  22.25,26.75 90 bottom
C22  26.25,26.75 90 bottom
C31  26.25,17 90 top
C32  30.62,16.75 90 top
C33  22.88,6.38 180 top
C34  23.25,16.75 270 top
C35  35.38,14.62 180 top
C36  34.75,16.75 270 top
C37  27.75,16.75 270 top
C40  32,16.75 270 bottom
C41  33.5,16.75 90 bottom
C43  31.88,6.75 180 bottom
C44  36.62,11.62 90 top
C45  33,11.62 90 top
D1  32.12,37.25 90 top
D2  32.12,32.75 90 top
D3  34.62,35.75 270 top
D4  32.12,37.38 180 bottom
D5  24.25,30 0 top
D6  28.25,30 0 top
DEBUG1  21.5,10.88 270 top
FET1  27.25,39 90 top
FET2  28.5,39 90 top
FET3  32.88,33.75 0 bottom
IC1  28.07,34.77 270 top
IC2  27.75,11.25 0 top
IC3  32.12,23.12 180 top
IC5  22.25,26.75 270 top
IC6  26.25,26.75 270 top
J1  29.5,2.5 0 top
J2  36.62,7.75 180 top
L1  28.12,46 0 top
L2  24.75,16.75 270 top
L4  3.9nH  [0402']  34.75,10.88 180 top
LED1  18,6.75 0 top
P14  20.5,4.5 0 bottom
P15  22,4.5 0 bottom
P16  23.5,4.5 0 bottom
P17  25,4.5 0 bottom
POWER  29.38,5.75 180 top
R1  34.88,32.75 0 top
R2  32.12,34.25 0 top
R3  31.38,35.75 90 bottom
R4  23,30 270 top
R5  27,30 270 top
R6  29.75,26.75 90 top
R7  31.38,19.88 90 top
R8  32.88,19.88 270 top
R9  31.38,19.88 90 bottom
R10  32.88,19.88 90 bottom
R14  18,6.75 90 bottom
R49  23.38,12.88 270 bottom
R60  31.75,6.75 180 top
SJ1  34.62,23.12 180 top
SJ2  19.25,37.12 90 top
TP1  33.5,52.25 0 top
TP2  23.25,52.25 0 top
TP3  16,45.75 0 top
TP4  21,22.25 0 top
TP5  31.5,27.5 0 top
TP6  21,20.75 0 top
TP7  21,19.25 0 top
TP8  16,48.75 0 top
UART  22,1.5 0 top
Y1  32.75,16.75 0 top

### Tracks (layer width: path | path; a pad name or v marks a point on that pad's centre or on a via)
!RESET!  (via drill 0.35)
  Top 0.152: IC2.24 29.95,7.05 30.25,6.75 v30.38,6.75 R60.2
  Bottom 0.152: C43.1 v30.38,6.75 30.25,6.75 30,7 29.42,7 29.2,6.78 28.8,6.78 28.53,7.05 28.53,7.22 27.38,8.38 23.62,8.38 23.38,8.62 22.75,8.62 22.46,8.34 DEBUG1.10
+3V3  (via drill 0.35)
  Top 0.254: 33.12,3.5 33.38,3.5 33.51,3.37 33.95,3.37 34.06,3.49 35.13,3.49 v35.25,3.37
  Top 0.305: IC3.4 31.48,22.27 C18.1 28.35,20.75 TP6.TP
  Top 0.406: J1.5 29.5,1.25 29.88,0.88 32.75,0.88 33.12,1.25 33.12,3.5 33.12,5.12 32.5,5.75 POWER.1
  Bottom 0.254: v35.25,3.37 36,2.62 37.12,2.62 39.62,5.12 39.62,8.51 39.5,8.62 | IC3.4 31.5,22.75 31.75,23 36,23
  other vias: 31.5,22.3
  pour Bottom (rank 2): 41.88,8.38 39.49,8.38 arc-25 35.78,25 41.62,25 arc-90 41.88,24.75
+4V7
  Top 0.203: IC1.1 29.88,36.5 29.88,35.62 30.5,35 32.62,35 32.77,35.15 C7.1
  Top 0.254: C5.1 31.48,37.98 31.38,37.88 D1.K 31.38,36.75 31.5,36.62 32.38,36.62 32.77,36.23 C7.1 D3.A
+5V  (via drill 0.35)
  Top 0.203: D1.A 33.72,36.4 34.28,36.4 34.82,35.86 34.82,35.24 34.88,35.19 34.88,32.12 34.75,32 v33.62,32 v33.62,31.99
  Top 0.254: v22.25,25 22.38,24.88 23.12,24.88 | v33.73,3.9 37.9,3.9 39.62,5.62 39.62,8.5 39.5,8.62 | R6.1 35.27,26.1 36,25.37 36,25 | R8.2 32.9,19.25 36.25,19.25 | 37.6,13.7
  Top 0.305: IC5.5 22.91,25.09 23.12,24.88 23.38,24.62 26,24.62 v26.25,24.88 26.75,24.88 26.91,25.04 | IC6.5 26.91,25.04 | 26.91,25.04 27.07,24.88 29.62,24.88 29.75,25 R6.1 | TP4.TP 21.88,22.25 22.12,22.5 22.12,24.62 22.38,24.88
  Bottom 0.203: R6.1 29.77,26.12 31.75,26.12 32.25,26.62 32.25,31.62 | v33.62,31.99 32.62,31.99 32.25,31.62 | C8.1 32.08,32.95 32.08,31.8 32.25,31.62
  Bottom 0.254: C22.1 v26.25,24.88 | C21.1 v22.25,25 | J1.6 29.5,3.88 29.75,4.12 33.62,4.12 33.75,4 33.75,3.92 v33.73,3.9
  other vias: 29.75,26.1
  pour Bottom (no thermals): 30.88,33.88 32.12,33.88 32.38,33.62 33.25,33.62 33.25,33.38 32,33.38 31.88,33.25 30.88,33.25
  pour Top (rank 2): 41.88,8.38 39.49,8.38 arc-25 35.78,25 41.62,25 arc-90 41.88,24.75
AGND  (via drill 0.35)
  other vias: 25.25,52.38 29.75,51.12 28.38,48.25 31,42.88 21.5,53.12 25.25,53.12 25.25,51.62 21.5,51.62 21.5,52.38 24.88,48.62 28,46 31.25,46.25 16.38,40.12 17.12,39 17.38,40.12 17.5,37.75 17.75,38.5 19.38,41.5 23.62,41.5 25.12,41.5 23.38,43.62 19.38,42.75 29.25,41 29.88,40 9.5,51.38 13.38,51.88 13,48.12 41.75,52.25 43.25,49.25 46.75,51.62 40.62,50.5 30.12,39.12 30.75,40.88
  pour Top (no thermals): 28.12,40 28.12,39.62 28.62,39.62 28.62,39 29.25,39 29.25,40
  pour Top (rank 5): -5.12,58.88 70.25,58.88 70.25,40 30.25,40 30.25,37.38 -5.12,37.38
  pour Bottom (rank 6): -8.38,60.88 71.25,60.88 71.25,40 30.25,40 30.25,37.38 -8.38,37.38
ANT
  pour Top (no thermals): 30.25,11.12 32.12,11.12 32.38,11.38 34.5,11.38 34.5,10.38 32,10.38 31.5,10.88 30.25,10.88
DEC4
  Top 0.203: IC2.46 26.35,14.85 26.62,15.12 27.5,15.12 27.75,15.38 C37.2
DEC5
  Top 0.152: IC2.1 24.79,14.56 24.1,15.25 23.5,15.25 23.25,15.5 C34.2
DEC6
  Top 0.152: C35.2 33.04,14.62 32.79,14.38 32.79,13.31 31.32,11.85 IC2.32
DEC8
  Top 0.152: C36.2 34.23,16.1 34.03,15.9 34.03,15.8 33.89,15.67 33.05,15.67 32.48,15.11 32.48,13.44 31.29,12.25 IC2.33
GBTST  (via drill 0.35)
  Top 0.305: R1.2 C6.1 35.52,34.98 35.38,35.12 D3.K
  Bottom 0.203: FET3.1 34.85,33.98 35.12,34.25 C6.1
  other vias: 35.52,34.25
GL  (via drill 0.31)
  Top 0.305: v29.38,32.25 30.12,32.25 30.62,32.75 D2.K 31.38,33.5 31.48,33.6 R2.1
  other vias: 28.5,37.62
  pour Top (no thermals): 28.12,38.25 28.88,38.25 28.88,37.38 28.12,37.38
  pour Top (no thermals): 28.62,33.25 29.88,33.25 29.88,32 28.62,32
  pour Bottom: 28.25,36.25 28.25,38 28.75,38 28.75,36.5 29.62,35.62 29.62,32 29.12,32 29.12,35.38
GND  (via drill 0.35)
  Top 0.152: IC2.EP v26.5,12.5 26.75,12.75 IC2.45
  Top 0.203: C2.2 28.15,26.12 29,26.12 29,25.62 v28.88,25.5
  Top 0.254: IC2.EP 27.95,11.45 IC2.31
  other vias: 26,29.12 24.12,25.25 27,35.75 28,34.75 27,34.75 27,33.75 28,33.75 28,35.75 28.12,31.88 26.88,31.5 30.5,36.5 30.5,35.88 27.75,11.25 27.75,12.5 26.5,11.25 26.5,10 27.75,10 29,10 29,11.25 29,12.5 16.25,6.25 13.5,1.75 26,6.25 22.88,10.25 32.38,9.88 33.12,9.88 33.88,9.88 34.62,9.88 35.38,9.88 34.5,9.25 37.62,9.62 37.62,10.38 37.62,11.12 37.5,11.88 36.12,11.88 35.38,11.88 34.62,11.88 33.88,11.88 32.12,11.88 31.12,4.88 35.62,5 20.75,0.62 20.75,2 21.25,6 23.75,21.88 27.12,21.75 25.88,21.5 24.38,23.12 26.38,23.12 25,19.38 23.25,19 23.12,8.12 24.62,7.25 37.25,5.12 35.88,1.75 40.25,5.62 42.62,1.5 34.62,1 38.12,1.25 33.5,13.38 34.25,12.62 35.38,12.75 36.5,13.38 36.38,5.62 38.62,5.62 36.88,3.25 36.12,3.25 31.25,25.25 34.25,25 34.62,27.25 33.25,26.88 36.38,37.62 22.75,35.88 24.12,35.12 22.5,33.62 24.88,33 34.88,38.62 38.12,38.62 37.5,35.88 34,30.12 30.88,30.38 29.5,28.62 35.25,20.25 34,21.62
  pour Top (rank 6): -6,36.75 30.88,36.75 30.88,39.38 64.25,39.38 64.25,-6.25 -6,-6.25
  pour Bottom (rank 6): -6.5,36.75 30.88,36.75 30.88,39.38 62.25,39.38 62.25,36.75 62.25,-6.5 -6.5,-6.5
  pour Top (no thermals): 28.12,38.75 29.62,38.75 30.38,38 30.38,36.75 30,36.75 30,38 29.5,38.5 29.38,38.5 28.12,38.5
  pour Top (rank 3, no thermals): 30.25,11.62 31.5,11.62 32.88,13 37.88,13 37.88,11.62 32.25,11.62 32,11.38 30.25,11.38
GU
  pour Top (no thermals): 27,36.25 27,38.12 27.12,38.25 27.5,38.25 27.62,38.12 27.62,37.25 27.75,37.12 28.25,37.12 28.25,36.25
HSIG
  Top 0.203: IC1.6 26.47,31.84 25.12,30.5 25.12,29.5 24.88,29.25 D5.A
  Top 0.305: R4.2 23.52,29.35 23.62,29.25 D5.A 24.12,29.12 C1.1
I2C_SCL  (via drill 0.35)
  Top 0.152: v29.62,15.5 29.34,15.22 29.34,15.21 29.32,15.18 29.25,15.12 29.19,15.06 29.15,15.02 IC2.39
  Bottom 0.152: J1.9 33,2.83 33.76,2.83 34.55,3.62 34.55,7.5 34,8.05 33.07,8.05 30.3,10.82 30.3,14.56 30.6,14.85 30.6,15.24 30.32,15.52 29.93,15.52 29.91,15.5 v29.62,15.5
I2C_SDA  (via drill 0.35)
  Top 0.152: IC2.38 29.55,14.69 29.74,14.88 30,14.88 30.12,15 v30.12,15.05
  Bottom 0.152: J1.10 33.64,3.13 34.25,3.75 34.25,7.38 33.88,7.75 32.9,7.75 30,10.65 30,14.92 v30.12,15.05
LED  (via drill 0.35)
  Top 0.152: IC2.16 26.75,7.22 26.53,7 26.53,5.88 26.4,5.75 25.71,5.75 25.57,5.89 24.43,5.89 24.12,5.58 23.05,5.58 22.61,5.14 22.46,5.14 22.32,5.28 21.68,5.28 21.2,4.8 20.87,4.8 20.62,5.04 v20.62,5.5 | v20.35,7.02 20.35,6.78 19.27,5.7 LED1.A
  Bottom 0.152: v20.62,5.5 20.62,6.75 v20.35,7.02
LSIG
  Top 0.203: R5.2 27,29.75 27.3,30.05 28.61,30.05 28.9,30.34 28.9,31.16 28.75,31.3 27.82,31.3 27.27,31.86 IC1.7
  Top 0.305: R5.2 27.02,29.38 27.5,29.38 27.62,29.25 D6.A 28.12,29.12 C2.1
N$1
  Bottom 0.203: R3.1 32.5,33.98 FET3.3
N$2  (via drill 0.35)
  Top 0.305: D5.K 23.62,30.75 23.5,30.62 23.02,30.62 R4.1 22.98,30.62 22,30.62 v21.62,30.25 | v20.99,26.86 21.59,26.27 IC5.4
  Bottom 0.305: v21.62,30.25 21,29.62 v21,26.88 v20.99,26.86
N$3
  Top 0.305: IC3.1 33.3,22.3 33.5,22.5 33.5,23 33.62,23.12 SJ1.2
N$4  (via drill 0.35)
  Top 0.305: D6.K 27.62,30.75 27.5,30.62 27.02,30.62 R5.1 26.27,30.65 v25.88,30.25 | v25.38,26.38 25.59,26.16 IC6.4
  Bottom 0.305: v25.88,30.25 25.38,29.75 v25.38,26.38
N$5  (via drill 0.35)
  Top 0.152: LED1.C v18,7.62
  Bottom 0.152: v18,7.62 R14.2
N$7
  pour Top: 32.5,34.5 34.38,34.5 34.38,32.5 32.5,32.5
N$8
  pour Top: 31.88,54.75 31.88,51.12 32.88,50.12 32.88,41.12 36.5,41.12 36.5,44.88 39.88,44.88 39.88,46.75 36.5,46.75 36.5,50.62 35.62,51.5 35.62,54.75
N$14  (via drill 0.35)
  Top 0.254: L2.1 25.02,17.48 25.38,17.12 25.38,16.52 25.38,15.5 25.75,15.12 v25.8,15.12
  Bottom 0.254: POWER.2 31.5,5.75 31.88,6.12 31.88,8.27 29.64,10.51 29.64,14.74 29.26,15.12 v25.8,15.12
  other vias: 28.97,5.75
OOK
  Top 0.152: IC5.2 22.25,27 22.5,26.75 25.08,26.75 25.18,26.85 25.57,26.85 25.65,26.77 26.02,26.77 26.25,27
  Top 0.254: 26.38,26.88 26.5,26.75 29.5,26.75 29.75,27 R6.2
  Top 0.305: R6.2 30.52,27.4 30.62,27.5 TP5.TP | IC6.2 26.25,27 26.38,26.88
OSC_CLK  (via drill 0.35)
  Top 0.254: IC6.1 26.91,28.16 v27.12,28.38 | v30.88,24 30.93,23.95 IC3.3 | IC5.1 22.91,28.16 v23.12,28.38
  Bottom 0.254: v30.88,24 27.12,24 26.88,24.25 | v23.12,28.38 24,28.38 24.38,28 24.38,26.62 25.62,25.38 25.62,24.5 25.88,24.25 26.88,24.25 | v27.12,28.38 27.12,24.5 26.88,24.25
OSC_ENABLE  (via drill 0.35)
  Top 0.152: IC2.40 28.75,15.05 29.04,15.33 29.04,18 29.16,18.12 v29.21,18.12 | v35,22.12 35.08,22.2 SJ1.1
  Bottom 0.152: v29.21,18.12 29.21,18.25 28.53,18.93 28.53,19.32 29.01,19.8 30.22,19.8 30.36,19.95 30.42,19.95 30.7,20.22 30.7,20.97 30.83,21.1 34.6,21.1 35,21.5 v35,22.12
OUT
  Top 0.152: FET1.5 27.75,40.1 27.75,40.75
  Top 1.016: L1.1 23,46 27.75,41.25 27.75,40.75
  pour Top (no thermals): 26.88,39.62 27.38,39.62 27.38,39 28.38,39 28.38,39.38 27.88,39.38 27.88,40.25 28.12,40.5 28.12,40.62 27.38,40.62 27.38,40 26.88,40
OUT+5V  (via drill 0.35)
  Top 0.203: IC1.2 29.12,36.96 29.12,37.62 v29.38,37.88
  Bottom 0.203: C9.1 32.67,35.1 R3.2 31.38,37.27 D4.1 30.5,37.38 30,37.88 v29.38,37.88
OUT_GU  (via drill 0.35)
  Bottom 0.203: v26.38,37.88 26.87,38.37 29.58,38.37 29.71,38.25 30.13,38.25 30.5,37.88 30.72,37.88 30.87,38.03 31.68,38.03 32.33,37.38 D4.2 32.98,36.5 C9.2
  pour Top (no thermals): 26.12,37 26.12,38.12 26.75,38.75 27.5,38.75 27.5,38.5 26.88,38.5 26.62,38.25 26.62,36.25 26.12,36.25
P06
  Top 0.152: UART.1 19.46,5.46 21.5,7.5 23.62,7.5 23.75,7.62 23.75,10.12 24.27,10.65 IC2.8
P08
  Top 0.152: UART.2 22,2.38 21.75,2.62 20.12,2.62 19.77,2.98 19.77,5.33 21.63,7.2 23.75,7.2 24.12,7.57 24.12,9.66 24.31,9.85 IC2.10
P14  (via drill 0.35)
  Top 0.152: IC2.17 27.15,7.19 26.84,6.88 26.84,5.75 26.5,5.41 25.62,5.41 25.45,5.58 24.55,5.58 24.25,5.28 23.18,5.28 22.7,4.8 22.37,4.8 22.2,4.97 21.8,4.97 21.33,4.5 P14.TP
  other vias: 20.5,4.5
P15  (via drill 0.35)
  Top 0.152: IC2.18 27.55,7.16 27.14,6.75 27.14,5.63 26.62,5.11 25.49,5.11 25.32,5.28 24.68,5.28 24.2,4.8 23.87,4.8 23.7,4.97 23.3,4.97 22.83,4.5 P15.TP
  other vias: 22,4.5
P16  (via drill 0.35)
  Top 0.152: IC2.19 27.95,7.13 27.45,6.63 27.45,5.5 26.75,4.8 25.37,4.8 25.2,4.97 24.8,4.97 24.33,4.5 P16.TP
  other vias: 23.5,4.5
P17  (via drill 0.35)
  Top 0.152: IC2.20 28.35,7.1 27.75,6.5 27.75,5.25 27,4.5 P17.TP
  other vias: 25,4.5
SWDCLK  (via drill 0.35)
  Top 0.152: IC2.25 30.71,8.09 v30.5,7.88
  Bottom 0.152: R49.2 23.3,12.14 | 23.3,12.14 DEBUG1.4 | 23.3,12.14 23.3,11.51 23.62,11.18 23.75,11.18 25.88,9.05 27.63,9.05 28.56,8.12 30.25,8.12 v30.5,7.88
SWDIO  (via drill 0.35)
  Top 0.152: v31.25,8.11 31.25,8.71 31.38,8.84 31.38,9.26 31.19,9.45 IC2.26
  Bottom 0.152: v31.25,8.11 30.93,8.43 28.68,8.43 27.75,9.36 26.13,9.36 24.05,11.43 24.05,12.67 23.92,12.8 22.75,12.8 DEBUG1.2
SWO/TDO  (via drill 0.35)
  Top 0.152: v29,7.25 28.75,7.5 IC2.21
  Bottom 0.152: DEBUG1.6 23.62,10.88 25.75,8.75 27.5,8.75 v29,7.25
UFL
  pour Top (no thermals): 35,11.38 37.12,11.38 37.12,8.75 36.12,8.75 36.12,10.38 35,10.38
V-5V
  Top 0.152: IC2.42 27.95,15.11 28.43,15.59 28.43,19.8 29.15,20.52 C3.1 R7.2 R8.1
V-VAMP  (via drill 0.35)
  Top 0.152: v29,19.12 28.73,18.86 28.73,15.46 28.35,15.08 IC2.41
  Bottom 0.152: v29,19.12 29.98,19.12 30.07,19.23 C4.1 29.9,19.25 30.62,19.25 30.7,19.32 30.7,19.67 30.83,19.8 31.18,19.8 31.38,20 | R9.2 31.38,20 | R10.1 32.15,19.23 32.05,19.32 32.05,19.67 31.92,19.8 31.57,19.8 31.38,20
VAMP  (via drill 0.35)
  Top 0.152: v33.72,20.5 33.55,20.67 33.55,20.97 33.42,21.1 33.15,21.1 33.12,21.12 29.26,21.12 28.51,20.37 21.99,20.37 21.62,20 v20.12,20
  Top 0.61: TP3.TP 17.62,45.75 18.25,45.12 18.25,40 19.27,38.98 22.62,38.98 C14.1
  Bottom 0.152: R10.2 32.9,20.5 v33.72,20.5
  other vias: 21.12,37.75 22.12,37.75 23.12,37.75 24.12,37.75
  pour Bottom (no thermals): 18.25,39.25 26.38,39.25 26.38,37.5 18.25,37.5
  pour Top (no thermals): 20.62,39.25 26.38,39.25 26.5,39.38 27.12,39.38 27.12,39 26.62,39 25,37.38 20.62,37.38
  pour Bottom (no thermals): 27.38,1.25 27.38,2.75 28.75,2.75 28.75,3.75 19.75,3.75 19.75,14.25 20.88,15.38 20.88,26.25 20.5,26.62 20.5,37.62 18.38,37.62 18.38,36.88 16.75,36.88 16.75,16.62 19.12,14.25 19.12,3.12 25.5,3.12 26.25,2.38 26.25,1.25
VDD_BLE  (via drill 0.35)
  Top 0.152: IC2.36 31.2,13.45 31.5,13.75 | 31.5,13.75 31.5,14.75 31.25,15 30.75,15 30.62,15.12 C32.1 30.02,16.1 v30,16.12 | L2.2 24.75,15.25 24.99,15.01 v25.01,15.01 25.24,15.01 25.55,14.7 IC2.48 | C33.1 25.12,6.38 25.55,6.8 v25.55,7.38 IC2.13 | DEBUG1.1 20.87,13.99 21.02,14.14 23.61,14.14 | 23.61,14.14 24,13.75 24,12.38 24.12,12.25 IC2.4 | 23.61,14.14 23.61,14.36 v23.88,14.62 | 31.5,13.75 31.12,13.75 30.88,14 v30.78,14 | v33.38,8.53 33.35,8.5 32.75,8.5 32.4,8.15 R60.1 33.12,6.03 v33.12,5.98
  Top 0.254: C31.1 v26.25,16.12
  Bottom 0.152: v23.88,14.62 24.25,15 v25,15 v25.01,15.01 26.12,16.12 v26.25,16.12 v30,16.12 | v30.78,14 30.61,13.83 30.61,10.95 33.06,8.5 33.38,8.5 v33.38,8.53 | v33.12,5.98 32.23,5.98 31.63,5.38 29.26,5.38 29.16,5.28 28.77,5.28 28.5,5.55 28.5,5.95 28.5,6.65 28.22,6.93 28.22,7.1 27.25,8.07 26,8.07 25.75,7.82 25.75,7.5 25.62,7.38 v25.55,7.38
XC1  (via drill 0.35)
  Top 0.152: Y1.3 33,17.25 32.7,16.95 32.7,15.79 32.18,15.27 32.18,13.57 31.26,12.65 IC2.34
  Top 0.203: Y1.3 v33.4,17.25
  Bottom 0.203: C41.2 33.5,17.38 33.62,17.25 v33.4,17.25
XC2  (via drill 0.35)
  Top 0.152: IC2.35 31.23,13.05 31.88,13.69 31.88,15.5 32.08,15.7 Y1.1 31.97,16.15 v31.97,16.12
  Bottom 0.152: C40.2 v31.97,16.12

### Text on the board
tPlace: Power Transmitting Unit | Jarne Van Mulders | NR014 | TX | RX | GND
tNames: V1.0 | GND | VAMP | OOK | +5V | +3V3 | GND